# Altium schematic sheet PowerRails.SchDoc
size A4; SheetNumber: 2; SheetTotal: 4
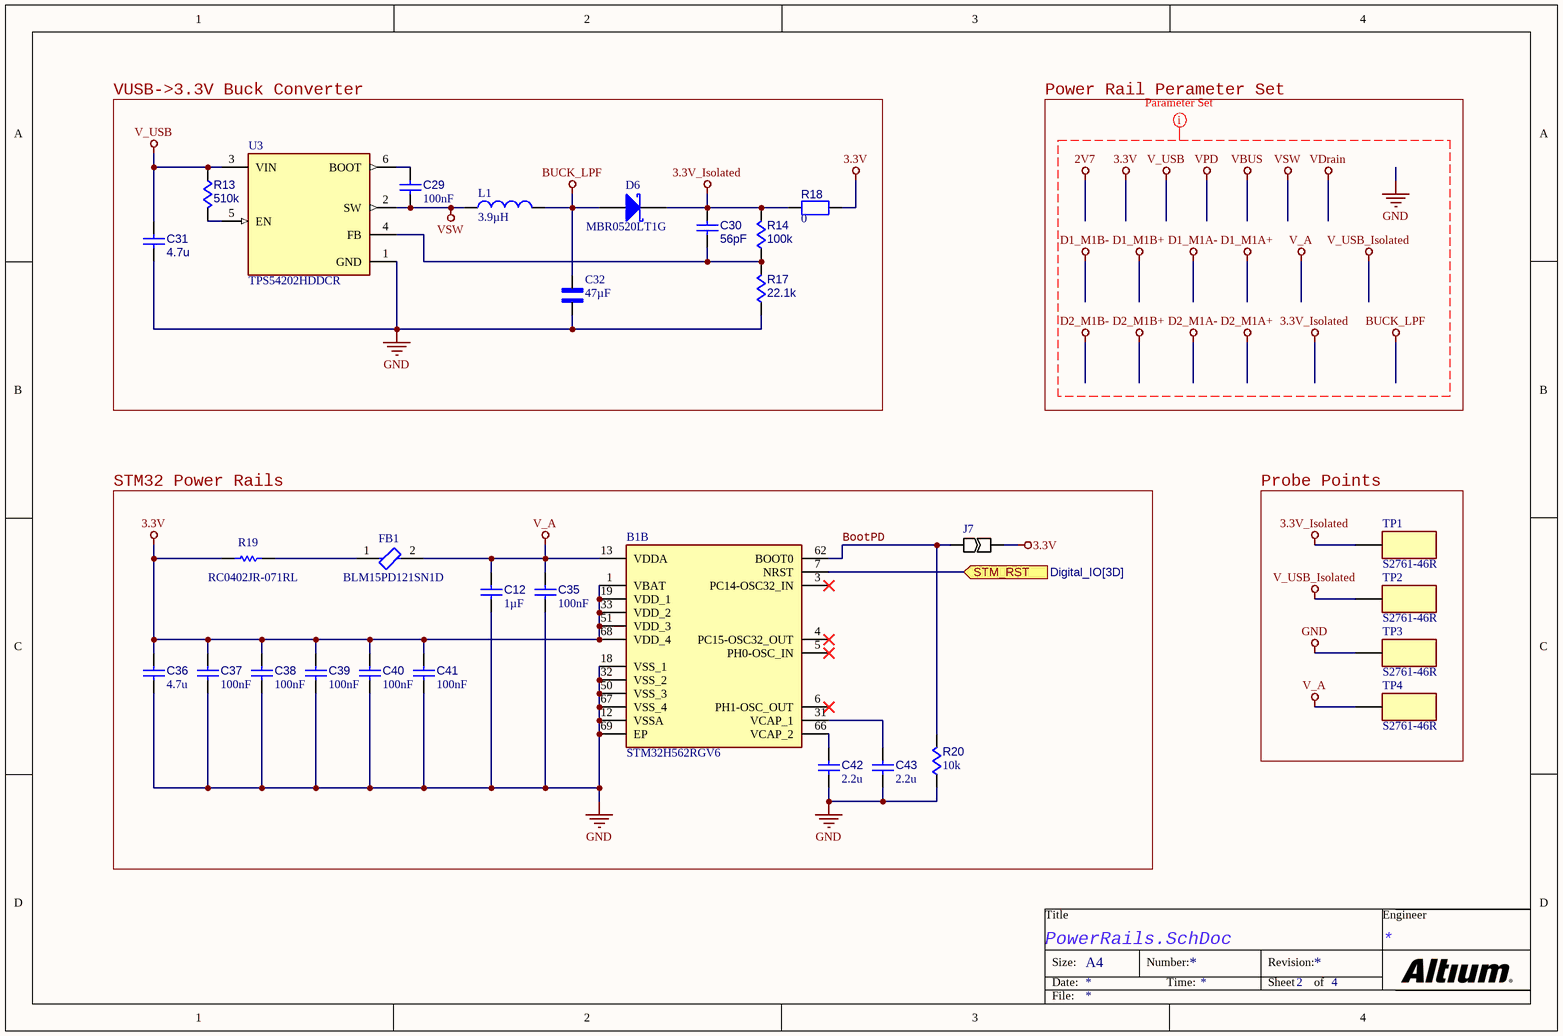
[diagram p0: PowerRails.SchDoc]

## Parts
B1  STM32H562RGV6  [QFN40P800X800X100-69N-D]  (part B of 2)
C12  value 1µF  [CAPC1608X94X35NL15T15]  (hidden comment: Capacitor 1 uF +/- 10% 16 V 0603)
C29  value 100nF  [CAPC0402(1005)60_L]  (hidden comment: Capacitor 100nF +/-20% 25V 0402)
C30  value 56pF  [CAPC0402(1005)60_L]  (hidden comment: Capacitors,ceramic,0402,5%,56pF)
C31  value 4.7u  [CAPC0805(2012)145_L]  (hidden comment: Capacitors,0805,4.7u)
C32  value 47µF  [CAPC3225X270N]  (hidden comment: GRM32ER61C476KE15L)
C35  value 100nF  [CAPC0402(1005)60_L]  (hidden comment: Capacitor 100nF +/-20% 25V 0402)
C36  value 4.7u  [CAPC0805(2012)145_L]  (hidden comment: Capacitors,0805,4.7u)
C37  value 100nF  [CAPC0402(1005)60_L]  (hidden comment: Capacitor 100nF +/-20% 25V 0402)
C38  value 100nF  [CAPC0402(1005)60_L]  (hidden comment: Capacitor 100nF +/-20% 25V 0402)
C39  value 100nF  [CAPC0402(1005)60_L]  (hidden comment: Capacitor 100nF +/-20% 25V 0402)
C40  value 100nF  [CAPC0402(1005)60_L]  (hidden comment: Capacitor 100nF +/-20% 25V 0402)
C41  value 100nF  [CAPC0402(1005)60_L]  (hidden comment: Capacitor 100nF +/-20% 25V 0402)
C42  value 2.2u  [CAPC0805(2012)145_L]  (hidden comment: Capacitors,0805,2.2u)
C43  value 2.2u  [CAPC0805(2012)145_L]  (hidden comment: Capacitors,0805,2.2u)
D6  MBR0520LT1G  [ONSC-SOD-123-2-425-04_V]
FB1  BLM15PD121SN1D  [FP-BLM15-0_05-IPC_B]
J7  JUMPER  [JUMPER]  (value not drawn)
L1  value 3.9µH  [SRR5018-3R9Y-Footprint-1]  (hidden comment: SRR5018-3R9Y)
R13  value 510k  [RESC0402(1005)_L]  (hidden comment: Resistors,0402,510k)
R14  value 100k  [RESC0402(1005)_L]  (hidden comment: Resistors,0402,100k)
R17  value 22.1k  [RESC0402(1005)_L]  (hidden comment: Resistors,0402,22.1k)
R18  value 0  [RESC0805(2012)_L]  (hidden comment: HCJ0805ZT0R00)
R19  RC0402JR-071RL  [RESC1005X40X25LL05T10]
R20  value 10k  [RESC0402(1005)_L]  (hidden comment: Resistors,0402,10k)
TP1  S2761-46R  [HARWIN_S2761-46R]
TP2  S2761-46R  [HARWIN_S2761-46R]
TP3  S2761-46R  [HARWIN_S2761-46R]
TP4  S2761-46R  [HARWIN_S2761-46R]
U3  TPS54202HDDCR  [FP-DDC0006A-IPC_C]

## Blocks framed on the sheet
VUSB->3.3V Buck Converter: C29-C32 D6 L1 R13 R14 R17 R18 U3
STM32 Power Rails: B1 C12 C35-C43 FB1 J7 R19 R20
Probe Points: TP1-TP4

## Ports
STM_RST (in, see Digital_IO[3D])

## Nets
3.3V: B1.1(VBAT) B1.19(VDD_1) B1.33(VDD_2) B1.51(VDD_3) B1.68(VDD_4) C36.2 C37.1 C38.1 C39.1 C40.1 C41.1 J7.2 R18.1 R19.1
3.3V_Isolated: C30.2 D6.2(K) R14.2 R18.2 TP1.1
BUCK_LPF: C32.1 D6.1(A) L1.2
GND: B1.12(VSSA) B1.18(VSS_1) B1.32(VSS_2) B1.50(VSS_3) B1.67(VSS_4) B1.69(EP) C12.1 C31.1 C32.2 C35.2 C36.1 C37.2 C38.2 C39.2 C40.2 C41.2 C42.1 C43.1 R17.1 R20.1 TP3.1 U3.1(GND)
V_A: B1.13(VDDA) C12.2 C35.1 FB1.2 TP4.1
V_USB: C31.2 R13.1 U3.3(VIN)
V_USB_Isolated: TP2.1
VSW: C29.1 L1.1 U3.2(SW)
BootPD: B1.62(BOOT0) J7.1 R20.2
STM_RST: B1.7(NRST) ; port STM_RST
NetB1_31: B1.31(VCAP_1) C43.2
NetB1_66: B1.66(VCAP_2) C42.2
NetC29_2: C29.2 U3.6(BOOT)
NetC30_1: C30.1 R14.1 R17.2 U3.4(FB)
NetFB1_1: FB1.1 R19.2
NetR13_2: R13.2 U3.5(EN)

Not connected (* = marked no-connect by the designer): B1 3(PC14-OSC32_IN)* 4(PC15-OSC32_OUT)* 5(PH0-OSC_IN)* 6(PH1-OSC_OUT)*

## Notes on the sheet
- Power Rail Perameter Set
- Title
- Engineer
- Size:
- Date:
- A4
- Number:
- Time:
- Revision:
- Sheet
- of
- File:

## Library data of the parts
B1 = CMP-004-000001-1: MCU 32-bit ARM Cortex M33 RISC 1MB Flash 1.8V/2.5V/3.3V 68-Pin VFQFPN EP Tray; Manufacturer_Name: STMicroelectronics; Geometry.Height: 1mm; Core Architecture: ARM Cortex-M33; Datasheet Link: https://www.st.com/resource/en/datasheet/stm32h562ag.pdf; Mouser Price/Stock: https://www.mouser.co.uk/ProductDetail/STMicroelectronics/STM32H563RGV6?qs=Jm2GQyTW%2FbjkEO3Um3%252BxKg%3D%3D; Mouser Part Number: 511-STM32H563RGV6; Design Item ID: STM32H563RGV6; Manufacturer_Part_Number: STM32H563RGV6; Source: STM32H563RGV6.SchLib; Memory Format: FLASH; REACH SVHC: Yes; Lifecycle Status: Production; Pins: 68; China RoHS: Compliant; RoHS: Compliant
C12 = CMP-001-00003-9: Chip Capacitor, 1 uF, +/- 10%, 16 V, 0603 (1608 Metric); Voltage Rating: 16V; Capacitor Type: Ceramic; RoHS Compliant: True; Case/Package: 0603; Tolerance: 10%; Mounting Technology: SM; Pins: 2; Min Operating Temperature: -55°C; Max Operating Temperature: 125°C
C29 C35 C37-C41 = CMP-001-00065-7: Chip Capacitor, 100nF +/-20%, 25V, 0402, Thickness 0.6 mm; Tolerance: 10%; Mounting Technology: SMT; Case/Package: 0402; Pins: 2; Min Operating Temperature: -55°C; Max Operating Temperature: 85°C; Voltage Rating: 25V
C30 = Capacitors: Capacitor, Filter; Case/Package: 0402; Capacitor Type: ceramic; Tolerance: 5%; Component Type: Capacitors
C31 C36 = Capacitors: Capacitor, Decoupling; Case/Package: 0805; Component Type: Capacitors
C32 = CMP-001-00087-1: SMD Capacitor X5R(EIA) with Capacitance: 47uF Tol. 10%. Rated Voltage: 16Vdc; MF: Murata Electronics; Case/Package: 3225 Murata; Pins: 2; Component Type: Standard; Source: GRM32ER61C476KE15L.SchLib; SnapEDA_Link: https://www.snapeda.com/parts/GRM32ER61C476KE15L/Murata+Electronics+North+America/view-part/?ref=snap; Design Item ID: GRM32ER61C476KE15L; MP: GRM32ER61C476KE15L; Check_prices: https://www.snapeda.com/parts/GRM32ER61C476KE15L/Murata+Electronics+North+America/view-part/?ref=eda
C42 C43 = Capacitors: Capacitor, Charge Pump; Case/Package: 0805; Component Type: Capacitors
D6 = CMP-004-00003-2: Schottky Power Rectifier, 20 V, 5.5 A, -65 to 125 degC, 2-Pin SMD, RoHS, Tape and Reel; Manufacturer: ON Semiconductor; Forward Current: 500mA; Peak Reverse Current: 250uA; Elements: 1; Forward Voltage: 385mV; Max Surge Current: 5.5A; Max Operating Temperature: 125°C; Min Operating Temperature: -65°C; Mounting Technology: SM; Datasheet URL: http://www.onsemi.cn/pub_link/Collateral/MBR0520LT1-D.PDF; RoHS Compliant: True; Pins: 2; Package Quantity: 3000; Case/Package: SOD; Package Reference: SOD-123-2-425-04; Package Description: 2-Pin Surface Mount Device, Body 2.69 x 1.6 mm; Packaging: TapeandReel; Manufacturer URL: http://www.onsemi.com/; Datasheet Version: Rev. 6, 01/2012
FB1 = CMP-0686-00281-4: Chip Ferrite Bead, 0402, 120Ω @ 100MHz, 0.09Ω, 25%, 1.3A; Impedance: 120R; Material: Steel; Number of Lines: 1; DC Resistance (DCR): 90mR; Number of Pins: 2; Military Standard: Not; Width: 0.5mm; Depth: 0.55mm; Lead Free: Lead Free; Test Frequency: 100MHz; Case Code (Metric): 1005; Case Code (Imperial): 0402; Current Rating: 1.3A; Package Quantity: 1; Height: 0.5mm; Radiation Hardening: No; Tolerance: 25%; Max DC Current: 1.3A; Packaging: Tape and Reel; REACH SVHC: No SVHC; Case/Package: 0402; Min Operating Temperature: -55°C; Max Current Rating: 1.3A; Length: 1mm; Number of Circuits: 1; Core Material: Ferrite; Max Operating Temperature: 125°C; Termination: SMD/SMT; DC Current: 1.3A
J7 = CMP-009-00061-10: Pins: 2
L1 = CMP-006-00022-2: Inductor Power Shielded Wirewound 3.9uH 30% 100KHz 8Q-Factor Ferrite 2A 0.055Ohm DCR T/R; DC Resistance (DCR): 55mΩ; Max Current Rating: 2.1A; Self Resonant Frequency: 64MHz; Q Factor: 8; Number of Circuits: 1; Harmonized Tariff Schedule (HTS) Code: 8504.50.80.00; Schedule B: 8504500000, 8504500000; Case Code (Imperial): 2323; Lifecycle Status: Production; Number of Terminals: 2; Height - Seated (Max): 1.8034mm; Termination: SMD/SMT; RoHS: Compliant; Depth: 6.1mm; Max DC Current: 2A; Tolerance: 30%; Min Operating Temperature: -40°C; Country of Origin: Mainland China; Export Control Classification Number (ECCN) Code: EAR99; Composition: Wirewound; Max Operating Temperature: 125°C; Military Standard: Not; Packaging: Tape and Reel; Test Frequency: 100kHz; Case Code (Metric): 5858; Introduction Date: 2007-08-29; Width: 5.8mm; Core Material: Ferrite; Shielding: Shielded; DC Current: 2A; Current Rating: 2A; Mounting Technology: Surface Mount; China RoHS: Compliant; Case/Package: 2323; Saturation Current: 2.1A; REACH SVHC: Yes; Length: 5.8mm; Height: 1.8mm
R13 R20 = Resistors: Resistor, Bootstrap; Case/Package: 0402; Component Type: Resistors
R14 R17 = Resistors: Resistor; Case/Package: 0402; Component Type: Resistors
R18 = CMP-009-00179-2: HCJ Series 0805 Jumper Surface Mount Chip Resistor; Manufacturer Package Identifier: 0805 (2012 metric); Power Rating: 500mW; DNP: TRUE; Mounting Technology: Surface Mount; Case/Package: 0805; Min Operating Temperature: -55°C; Max Operating Temperature: 155°C; Number of Terminals: 2; Export Control Classification Number (ECCN) Code: EAR99; Ratings: AEC-Q200; Radiation Hardening: No; Width: 1.2mm; Number of Terminations: 2; Length: 2mm; REACH SVHC: Yes; Harmonized Tariff Schedule (HTS) Code: 8533.21.00.30; Introduction Date: 2013-09-03; Termination: Wraparound; Lead Free: Lead Free; Packaging: Cut Tape (CT); Case Code (Metric): 2012; RoHS: Compliant; Country of Origin: Taiwan; Lifecycle Status: Production; Schedule B: 8533210045, 8533210045; Case Code (Imperial): 0805; Height: 650µm; Composition: Metal Strip
R19 = CMP-2002-07953-1: Manufacturer: Yageo / Phycomp; Part Number: RC0402JR-071RL
TP1-TP4 = CMP-028-000000-3: MF: {'manufacturer': u'Harwin Inc.'}; Availability: Unavailable; Design Item ID: S2761-46R; MP: S2761-46R; Price: None; Pin Count: 1; Package: None; Component Type: Standard; Source: S2761-46R.SchLib; Value: *
U3 = CMP-019-00052-1: 4.5V to 28V Input, 2A Output, Synchronous Step-Down Voltage Converter 6-SOT-23-THIN -40 to 125; Manufacturer Lifecycle Status: ACTIVE; Quiescent Current: 40µA; Max Junction Temperature (Tj): 125°C; Topology: Buck; Nominal Supply Current: 45µA; Max Duty Cycle: 100%; Number of Outputs: 1; Switching Frequency: 500kHz; Max Supply Voltage: 28V; Length: 2.9mm; Lifecycle Status: Production; Max Operating Temperature: 125°C; Output Current: 2A; Thickness: 870µm; Pins: 6; RoHS: Compliant; Height: 1.1mm; Min Operating Temperature: -40°C; Width: 1.6mm; Lead Free: Lead Free; Min Supply Voltage: 4.5V; Schedule B: 8542390000, 8542390000